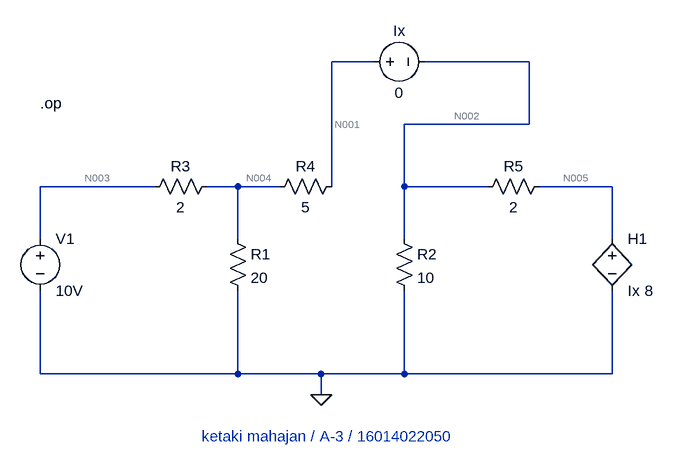
[diagram p0: schematic exp1_1_16014022050.asc]
exp1_1_16014022050.asc, the LTspice schematic file:
Version 4
SHEET 1 880 680
WIRE 240 -224 176 -224
WIRE 480 -224 320 -224
WIRE 480 -128 480 -224
WIRE 480 -128 288 -128
WIRE -96 -32 -272 -32
WIRE 32 -32 -16 -32
WIRE 96 -32 32 -32
WIRE 176 -32 176 -224
WIRE 288 -32 288 -128
WIRE 416 -32 288 -32
WIRE 608 -32 496 -32
WIRE -272 48 -272 -32
WIRE 32 48 32 -32
WIRE 288 48 288 -32
WIRE 608 48 608 -32
WIRE -272 256 -272 128
WIRE 32 256 32 128
WIRE 32 256 -272 256
WIRE 160 256 32 256
WIRE 288 256 288 128
WIRE 288 256 160 256
WIRE 608 256 608 128
WIRE 608 256 288 256
WIRE 160 288 160 256
FLAG 160 288 0
SYMBOL res 192 -48 R90
WINDOW 0 0 56 VBottom 2
WINDOW 3 32 56 VTop 2
SYMATTR InstName R4
SYMATTR Value 5
SYMBOL res 0 -48 R90
WINDOW 0 0 56 VBottom 2
WINDOW 3 32 56 VTop 2
SYMATTR InstName R3
SYMATTR Value 2
SYMBOL res 512 -48 R90
WINDOW 0 0 56 VBottom 2
WINDOW 3 32 56 VTop 2
SYMATTR InstName R5
SYMATTR Value 2
SYMBOL res 16 32 R0
SYMATTR InstName R1
SYMATTR Value 20
SYMBOL res 272 32 R0
SYMATTR InstName R2
SYMATTR Value 10
SYMBOL voltage -272 32 R0
SYMATTR InstName V1
SYMATTR Value 10V
SYMBOL voltage 224 -224 R270
WINDOW 0 32 56 VTop 2
WINDOW 3 -32 56 VBottom 2
WINDOW 123 0 0 Left 0
WINDOW 39 0 0 Left 0
SYMATTR InstName Ix
SYMATTR Value 0
SYMBOL h 608 32 R0
SYMATTR InstName H1
SYMATTR Value Ix 8
TEXT -272 -160 Left 2 !.op
TEXT -24 352 Left 2 ;ketaki mahajan / A-3 / 16014022050

The netlist it stands for:
* exp1_1_16014022050.asc
R4 N001 N004 5
R3 N004 N003 2
R5 N005 N002 2
R1 N004 0 20
R2 N002 0 10
V1 N003 0 10V
V§Ix N001 N002 0
H1 N005 0 Ix 8
.op
* ketaki mahajan / A-3 / 16014022050
.backanno
.end

* Results of the author's LTspice run, read from the files saved beside the schematic
* Operating Point:
*   V(n001) = 5 V
*   V(n004) = 8 V
*   V(n003) = 10 V
*   V(n005) = 4.8 V
*   V(n002) = 5 V
*   I(H1) = 100 mA
*   I(R4) = -600 mA
*   I(R3) = -1 A
*   I(R5) = -100 mA
*   I(R1) = 400 mA
*   I(R2) = 500 mA
*   I(V1) = -1 A
*   I(Ix) = 600 mA